# EAGLE design esp8266player3 (EAGLE 6.4)
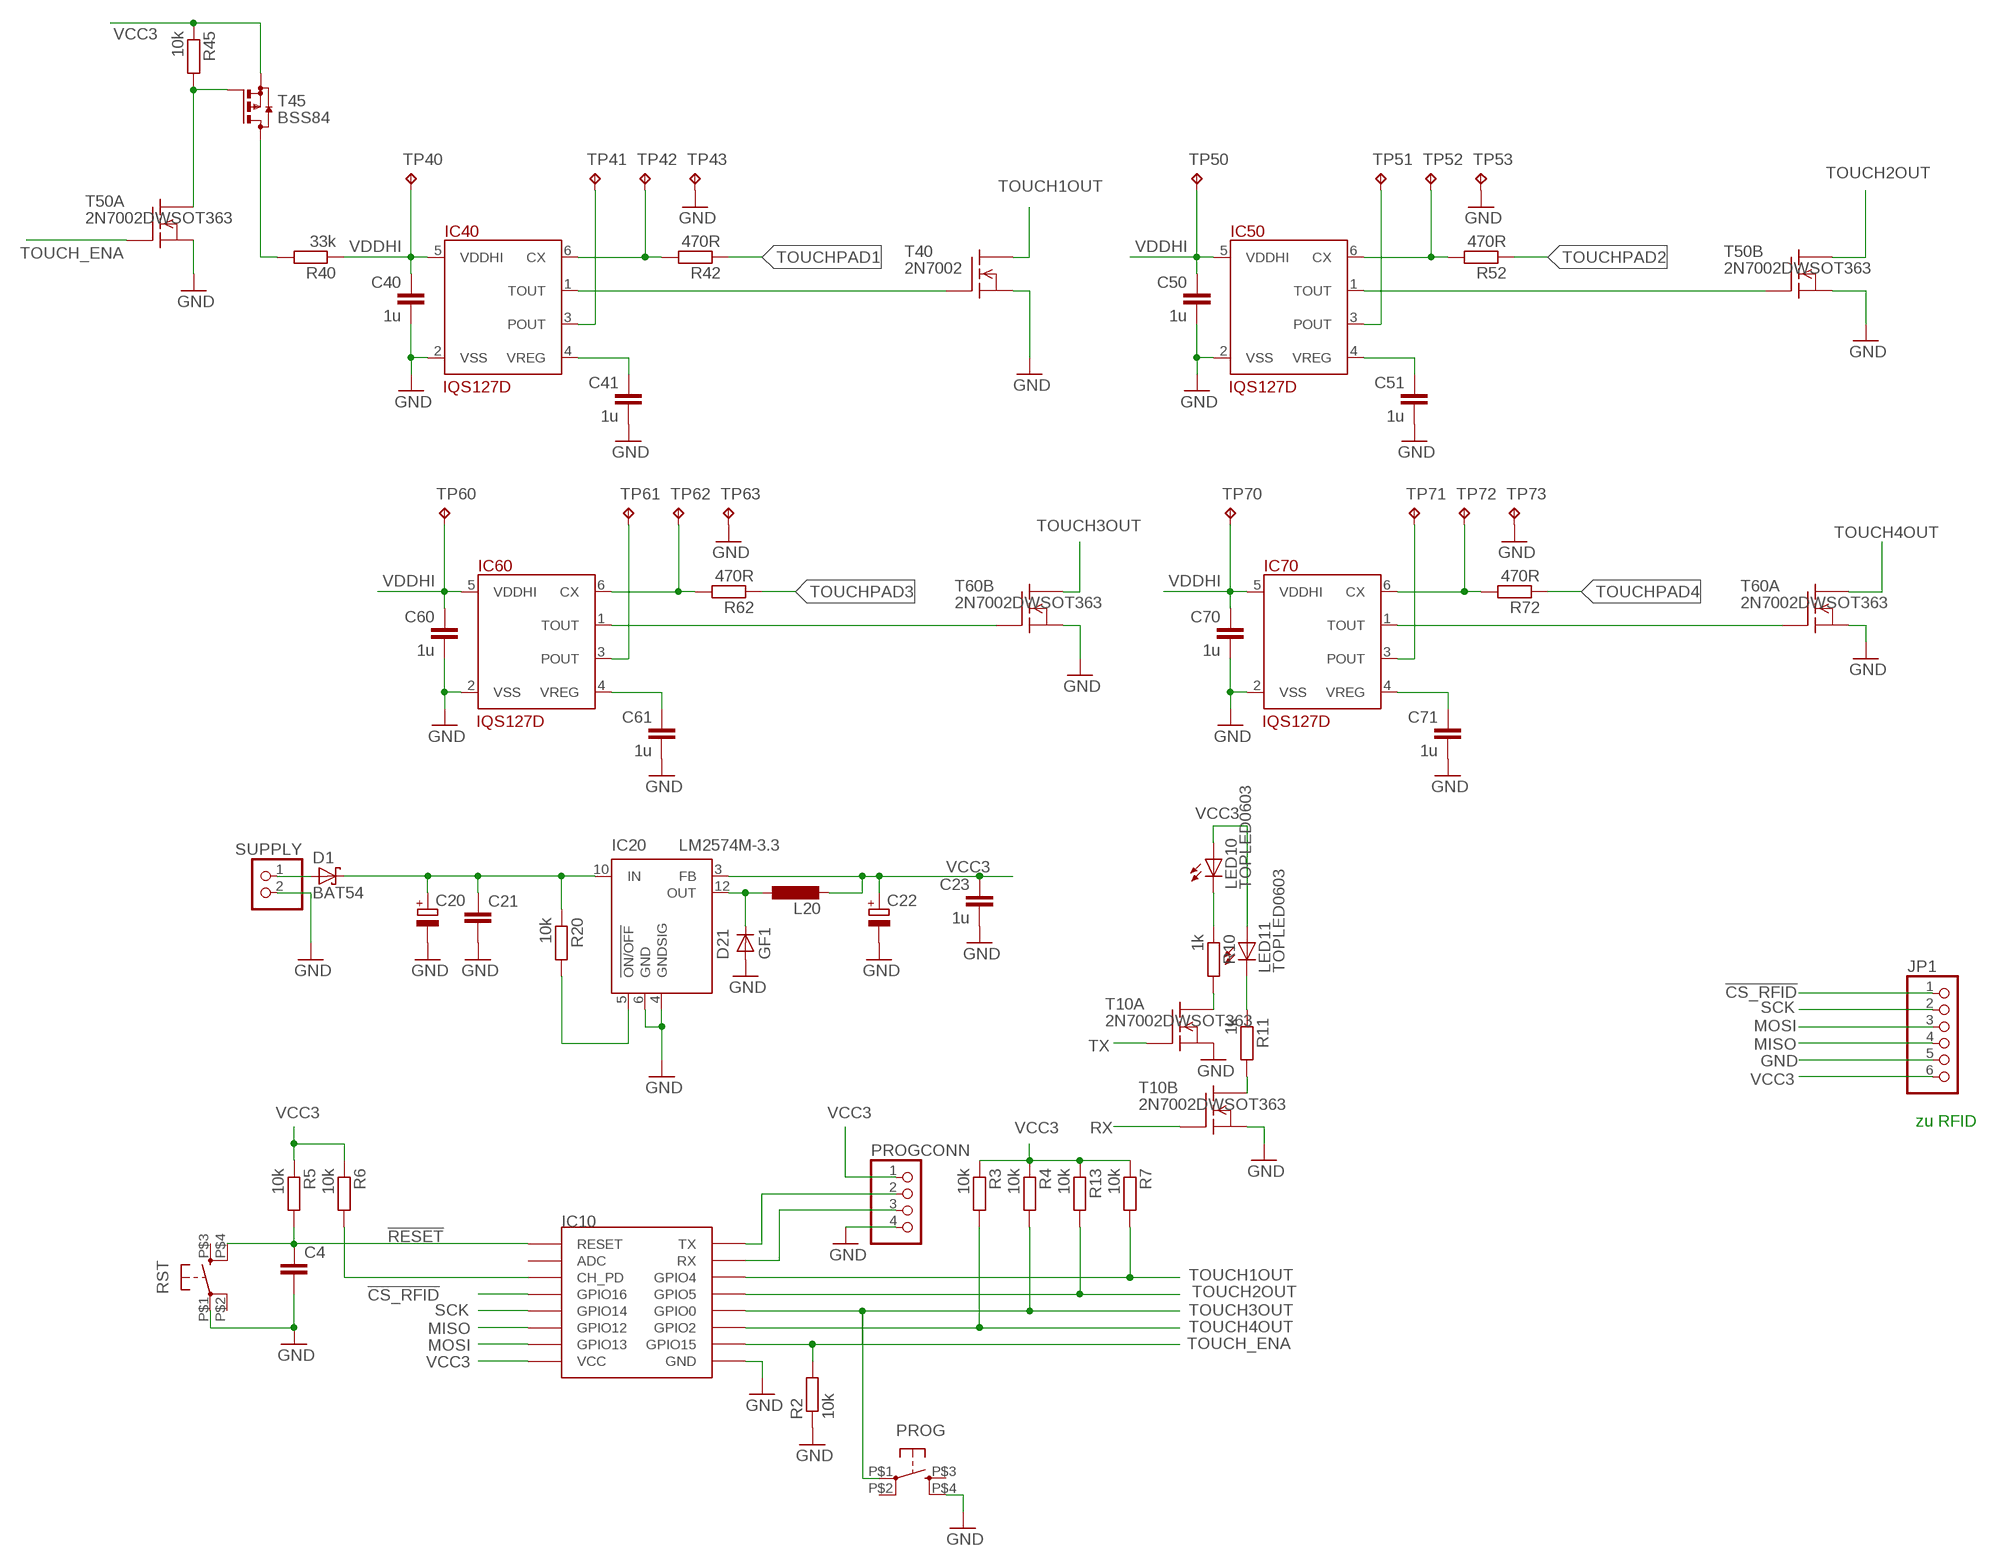
[diagram p0: schematic, sheet 1]

## Parts
C4  C-EUC0603  [C0603]
C20  CPOL-EUC  [PANASONIC_C]
C21  C-EUC1206  [C1206]
C22  CPOL-EUF  [PANASONIC_F]
C23  1u  C-EUC0603  [C0603]
C40  1u  C-EUC0603  [C0603]
C41  1u  C-EUC0603  [C0603]
C50  1u  C-EUC0603  [C0603]
C51  1u  C-EUC0603  [C0603]
C60  1u  C-EUC0603  [C0603]
C61  1u  C-EUC0603  [C0603]
C70  1u  C-EUC0603  [C0603]
C71  1u  C-EUC0603  [C0603]
D1  BAT54  [SOT23]
D21  GF1  [SMA-DO214AC]
IC10  ESP12SMD  [ESP12-SMD]
IC20  LM2574M-3.3  [SO14W]
IC40  IQS127D  [SOT23-6]
IC50  IQS127D  [SOT23-6]
IC60  IQS127D  [SOT23-6]
IC70  IQS127D  [SOT23-6]
JP1  PINHD-1X6  [1X06]
L20  L-EUSRR0603  [SRR6603-BOURNS]
LED10  TOPLED0603  [LED-0603-OSRAM]
LED11  TOPLED0603  [LED-0603-OSRAM]
PROG  10-XXTL3305  [TL3305]
PROGCONN  PINHD-1X4  [1X04]
R2  10k  R-EU_R0603  [R0603@1]
R3  10k  R-EU_R0603  [R0603@1]
R4  10k  R-EU_R0603  [R0603@1]
R5  10k  R-EU_R0603  [R0603@1]
R6  10k  R-EU_R0603  [R0603@1]
R7  10k  R-EU_R0603  [R0603@1]
R10  1k  R-EU_R0603  [R0603@1]
R11  1k  R-EU_R0603  [R0603@1]
R13  10k  R-EU_R0603  [R0603@1]
R20  10k  R-EU_R0603  [R0603@1]
R40  33k  R-EU_R0603  [R0603@1]
R42  470R  R-EU_R0603  [R0603@1]
R45  10k  R-EU_R0603  [R0603@1]
R52  470R  R-EU_R0603  [R0603@1]
R62  470R  R-EU_R0603  [R0603@1]
R72  470R  R-EU_R0603  [R0603@1]
RST  10-XXTL3305  [TL3305]
SUPPLY  PINHD-1X2  [1X02]
T10  2N7002DWSOT363  [SOT363]
T40  2N7002  [SOT23]
T45  BSS84  [SOT23]
T50  2N7002DWSOT363  [SOT363]
T60  2N7002DWSOT363  [SOT363]
TP40  TPB1,27  [B1,27]
TP41  TPB1,27  [B1,27]
TP42  TPB1,27  [B1,27]
TP43  TPB1,27  [B1,27]
TP50  TPB1,27  [B1,27]
TP51  TPB1,27  [B1,27]
TP52  TPB1,27  [B1,27]
TP53  TPB1,27  [B1,27]
TP60  TPB1,27  [B1,27]
TP61  TPB1,27  [B1,27]
TP62  TPB1,27  [B1,27]
TP63  TPB1,27  [B1,27]
TP70  TPB1,27  [B1,27]
TP71  TPB1,27  [B1,27]
TP72  TPB1,27  [B1,27]
TP73  TPB1,27  [B1,27]

## Nets
!CS_RFID: IC10.GPIO16 JP1.1
!RESET: C4.1 IC10.RESET R5.2 RST.P$4(S1)
GND: C4.2 C20.- C21.2 C22.- C23.2 C40.2 C41.2 C50.2 C51.2 C60.2 C61.2 C70.2 C71.2 D21.A IC10.GND IC20.4(GNDSIG) IC20.6(GND) IC40.2(VSS) IC50.2(VSS) IC60.2(VSS) IC70.2(VSS) JP1.5 PROG.P$4(S1) PROGCONN.4 R2.1 RST.P$1(P) SUPPLY.2 T10.1(B:S) T10.4(A:S) T40.2(S) T50.1(B:S) T50.4(A:S) T60.1(B:S) T60.4(A:S) TP43.TP TP53.TP TP63.TP TP73.TP
MISO: IC10.GPIO12 JP1.4
MOSI: IC10.GPIO13 JP1.3
N$1: IC20.5(!ON/OFF) R20.2
N$2: D1.1(A) SUPPLY.1
N$3: R11.2 T10.6(B:D)
N$4: LED11.K@1(C) R11.1
N$5: D21.K(C) IC20.12(OUT) L20.1
N$6: LED10.K@1(C) R10.1
N$7: R10.2 T10.3(A:D)
N$9: IC10.CH_PD R6.2
POUT_PROT1: IC60.3(POUT) TP61.TP
POUT_PROT2: IC40.3(POUT) TP41.TP
POUT_PROT3: IC70.3(POUT) TP71.TP
POUT_PROT4: IC50.3(POUT) TP51.TP
RX: IC10.RXD0(RX) PROGCONN.3 T10.2(B:G)
SCK: IC10.GPIO14 JP1.2
TOUCH1: IC40.1(TOUT) T40.1(G)
TOUCH1OUT: IC10.GPIO4 R7.2 T40.3(D)
TOUCH2: IC50.1(TOUT) T50.2(B:G)
TOUCH2OUT: IC10.GPIO5 R13.2 T50.6(B:D)
TOUCH3: IC60.1(TOUT) T60.2(B:G)
TOUCH3OUT: IC10.GPIO0 PROG.P$1(P) R4.2 T60.6(B:D)
TOUCH4: IC70.1(TOUT) T60.5(A:G)
TOUCH4OUT: IC10.GPIO2 R3.2 T60.3(A:D)
TOUCH_ENA: IC10.GPIO15 R2.2 T50.5(A:G)
TOUCH_ENA2: R45.2 T45.1(G) T50.3(A:D)
TOUCHPAD1: R42.1
TOUCHPAD2: R52.1
TOUCHPAD3: R62.1
TOUCHPAD4: R72.1
TT: IC60.6(CX) R62.2 TP62.TP
TT1: IC40.6(CX) R42.2 TP42.TP
TT2: IC70.6(CX) R72.2 TP72.TP
TT3: IC50.6(CX) R52.2 TP52.TP
TX: IC10.TXD0(TX) PROGCONN.2 T10.5(A:G)
VCC3: C22.+ C23.1 IC10.VCC IC20.3(FB) JP1.6 L20.2 LED10.A@1(A) LED11.A@1(A) PROGCONN.1 R3.1 R4.1 R5.1 R6.1 R7.1 R13.1 R45.1 T45.2(S)
VCC3_TOUCH: R40.2 T45.3(D)
VDDHI [supply]: C40.1 C50.1 C60.1 C70.1 IC40.5(VDDHI) IC50.5(VDDHI) IC60.5(VDDHI) IC70.5(VDDHI) R40.1 TP40.TP TP50.TP TP60.TP TP70.TP
VIN: C20.+ C21.1 D1.3(C) IC20.10(IN) R20.1
VREG1: C61.1 IC60.4(VREG)
VREG2: C41.1 IC40.4(VREG)
VREG3: C71.1 IC70.4(VREG)
VREG4: C51.1 IC50.4(VREG)
Unconnected: IC10.ADC PROG.P$2(P1) PROG.P$3(S) RST.P$2(P1) RST.P$3(S)

## Notes on the sheet
- zu RFID

## Library data of the parts
C4 C21 C23 C40 C41 C50 C51 C60 C61 C70 C71 = myKNX:C-EU: CAPACITOR, European symbol
C20 C22 = resistor:CPOL-EU: POLARIZED CAPACITOR, European symbol
D1 = diode:BAT54: Schottky Diodes Source: Fairchild .. BAT54.pdf
D21 = diode:GF1: DIODE
IC10 = esp8266:ESP12: ESP8266 Wifi module 12
IC20 = linear:LM2574?-*: SIMPLE SWITCHER 0.5A Step-Down Voltage Regulator Source: http://cache.national.com/ds/LM/LM2574.pdf
IC40 IC50 IC60 IC70 = myKNX:IQS127D
JP1 = pinhead:PINHD-1X6: PIN HEADER
L20 = myKNX:L-EU: INDUCTOR, European symbol
LED10 LED11 = myKNX:TOPLED
PROG RST = myKNX:10-XX: OMRON SWITCH
PROGCONN = pinhead:PINHD-1X4: PIN HEADER
R2-R7 R10 R11 R13 R20 R40 R42 R45 R52 R62 R72 = myKNX:R-EU_: RESISTOR, European symbol
SUPPLY = myKNX:PINHD-1X2: PIN HEADER
T10 T50 T60 = myKNX:2N7002DW
T40 = myKNX:2N7002
T45 = transistor-small-signal:BSS84: P-CHANNEL MOS FET
TP40-TP43 TP50-TP53 TP60-TP63 TP70-TP73 = testpad:TP: Test pad

## Net classes
1 supply: width 0.15 mm

## Board
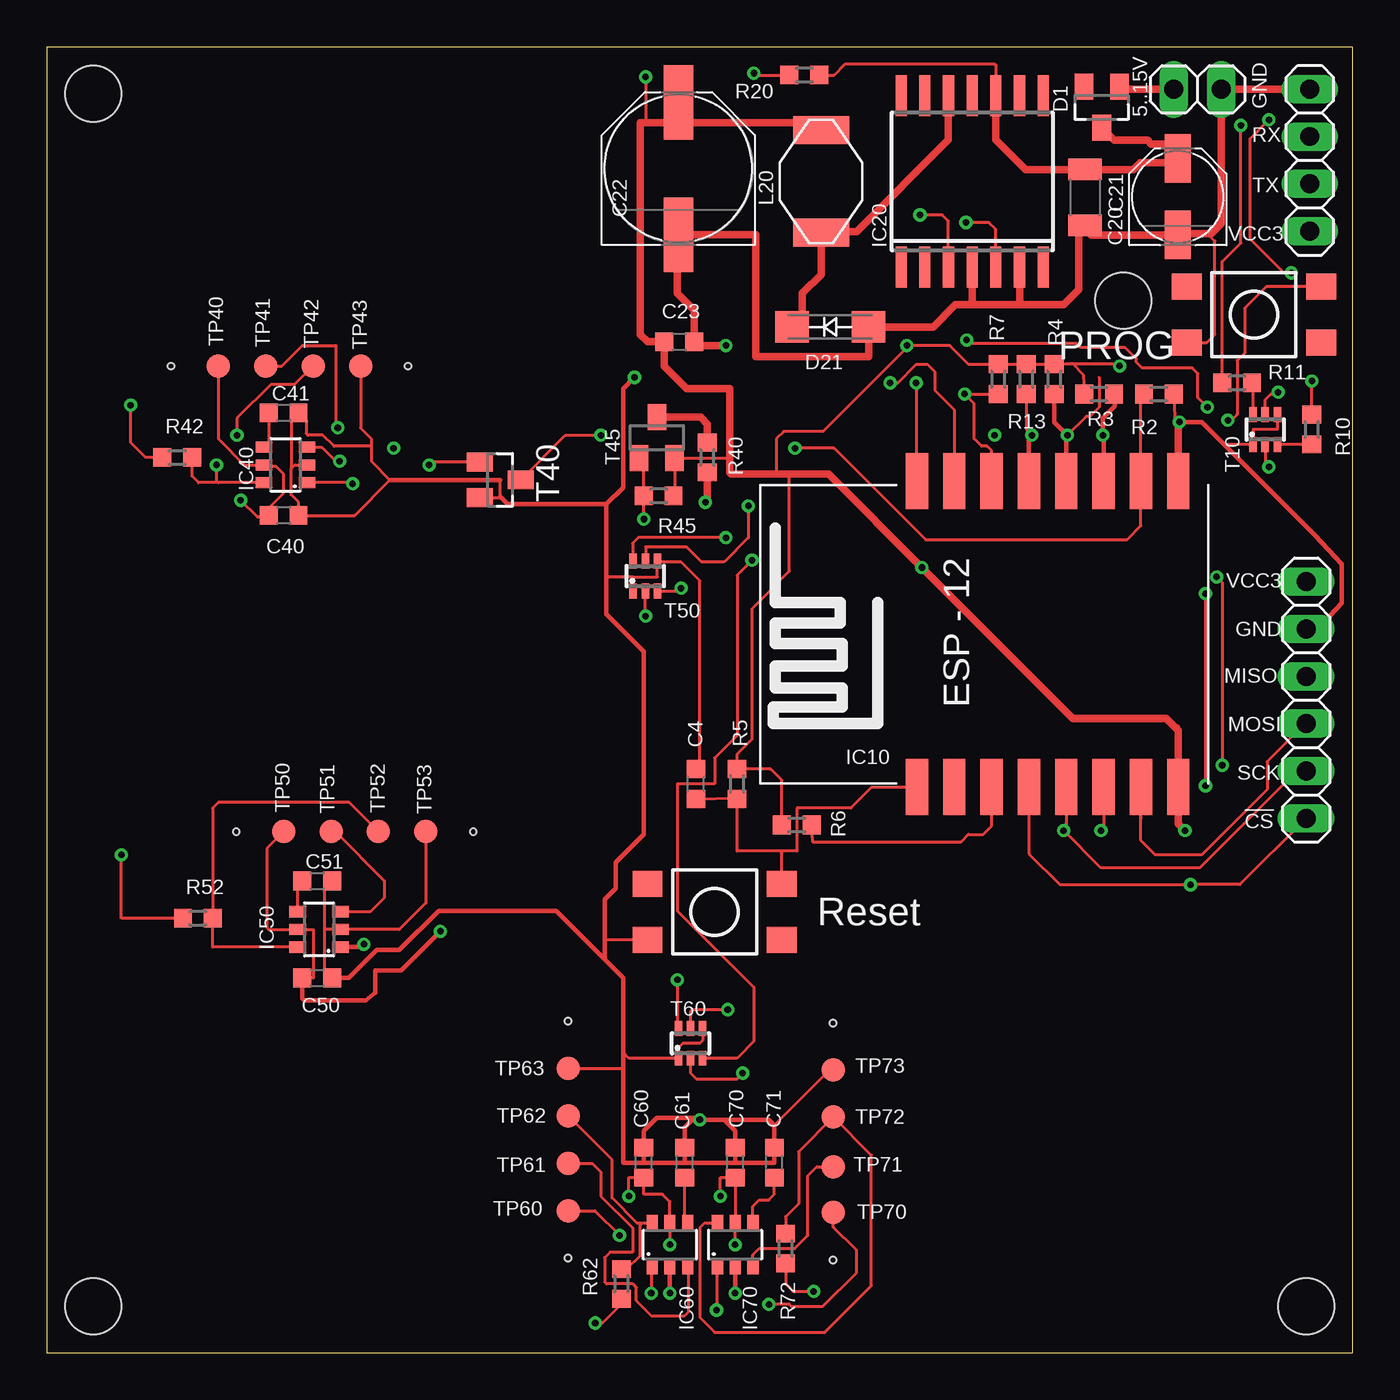
[diagram p1: board, top side]
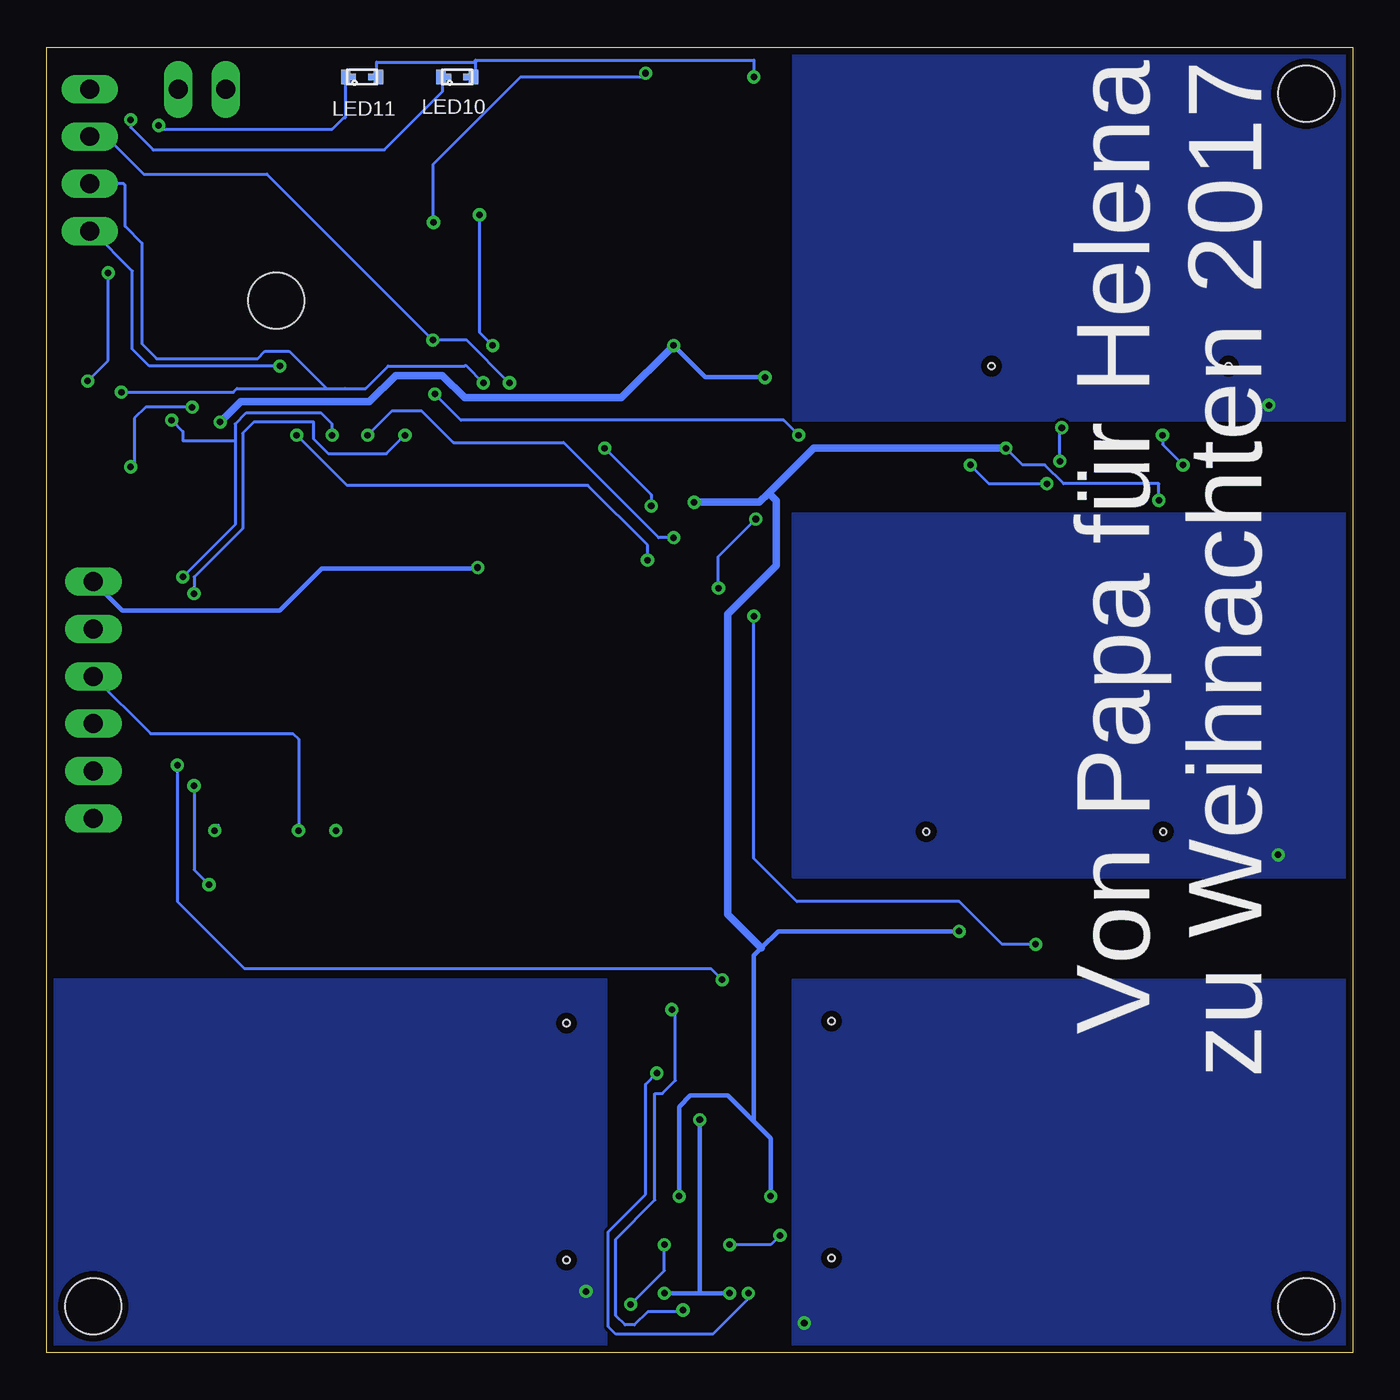
[diagram p2: board, bottom side, seen from below]

Size 70 x 70 mm. Coordinates in mm from the lower left corner, seen from the top.
Outline: 0,0 70,0 70,70 0,70 0,0
Copper layers (1*16): Top 0.0356mm / dielectric 1.5011mm / Bottom 0.0356mm
Design rules "OSHPark": minimum track width 6mil, minimum drill 13mil, track to track 6mil, track to pad 6mil, pad to pad 6mil, via to via 6mil, smd to smd 6mil, copper to edge 15mil, drill to drill 6mil, minimum pad ring 7mil, minimum via ring 7mil, stop-mask expansion 4mil, vias tented up to drill 0mil, thermal gap 10mil
Holes 0.35 mm at 42.14,17.68 42.14,4.98 27.94,17.78 27.94,5.08 10.16,27.94 22.86,27.94 6.66,52.9 19.36,52.9
Holes 3 mm at 2.5,2.5 67.5,2.5 57.7,56.4 2.5,67.5

### Footprints (pad centres in the part's own frame; a part is rotated, then mirrored left to right if it is on the bottom)
C0603 = smd 0.95 x 1: 1 -0.8,0; 2 0.8,0
PANASONIC_C = smd 2.6 x 1.4: + 2.05,0; - -2.05,0
C1206 = smd 1.15 x 1.8: 1 -1.5,0; 2 1.5,0
PANASONIC_F = smd 4 x 1.6: + 3.55,0; - -3.55,0
SOT23 = smd 1 x 1.4: 1 -0.95,-1.1; 2 0.95,-1.1; 3 0,1.1
SMA-DO214AC = smd 1.8 x 1.7: A -2.05,0; K 2.05,0
ESP12-SMD = smd 3 x 1.2: ADC -8.3,3.8; CH_PD -8.3,1.8; GND 8.1,-8.2; GPIO0 8.1,-2.2; GPIO2 8.1,-4.2; GPIO4 8.1,1.8; GPIO5 8.1,-0.2; GPIO12 -8.3,-4.2; GPIO13 -8.3,-6.2; GPIO14 -8.3,-2.2; GPIO15 8.1,-6.2; GPIO16 -8.3,-0.2; RESET -8.3,5.8; RXD0 8.1,3.8; TXD0 8.1,5.8; VCC -8.3,-8.2
SO14W = smd 0.6 x 2.2: 1 -3.81,-4.6; 2 -2.54,-4.6; 3 -1.27,-4.6; 4 0,-4.6; 5 1.27,-4.6; 6 2.54,-4.6; 7 3.81,-4.6; 8 3.81,4.6; 9 2.54,4.6; 10 1.27,4.6; 11 0,4.6; 12 -1.27,4.6; 13 -2.54,4.6; 14 -3.81,4.6
SOT23-6 = smd 0.6 x 0.9: 1 -0.95,-1.15; 2 0,-1.15; 3 0.95,-1.15; 4 0.95,1.15; 5 0,1.15; 6 -0.95,1.15
1X06 = drill 1.016 long: 1 -6.35,0; 2 -3.81,0; 3 -1.27,0; 4 1.27,0; 5 3.81,0; 6 6.35,0
SRR6603-BOURNS = smd 1.5 x 3: 1 -2.75,0; 2 2.75,0
LED-0603-OSRAM = smd 0.5 x 0.8: A@1 0.875,0; K@1 -0.875,0 | smd 0.8 x 0.35: A@2 0.725,0; K@2 -0.725,0
TL3305 = smd 1.6 x 1.4: P$1 -3.6,-1.5; P$2 3.6,-1.5; P$3 -3.6,1.5; P$4 3.6,1.5
1X04 = drill 1.016 long: 1 -3.81,0; 2 -1.27,0; 3 1.27,0; 4 3.81,0
R0603@1 = smd 0.95 x 1: 1 -0.8,0; 2 0.8,0
1X02 = drill 1.016 long: 1 -1.27,0; 2 1.27,0
SOT363 = smd 0.4 x 0.8: 1 -0.65,-0.8; 2 0,-0.8; 3 0.65,-0.8; 4 0.65,0.8; 5 0,0.8; 6 -0.65,0.8
B1,27 = smd 1.27 x 1.27: TP 0,0

### Placement (x,y rotation side)
C4  34.8,30.5 90 top
C20  60.62,61.97 90 top
C21  55.64,61.94 270 top
C22  33.86,63.49 90 top
C23  33.9,54.2 0 top
C40  12.7,44.9 0 top
C41  12.7,50.4 0 top
C50  14.5,20.1 0 top
C51  14.5,25.3 0 top
C60  32,10.2 90 top
C61  34.2,10.2 90 top
C70  36.9,10.2 90 top
C71  39,10.2 90 top
D1  56.54,66.77 180 top
D21  42,55 180 top
IC10  52.44,38.63 90 top
IC20  49.6,62.8 0 top
IC40  12.8,47.6 90 top
IC50  14.6,22.7 90 top
IC60  33.4,5.8 0 top
IC70  36.9,5.8 0 top
JP1  67.5,35 90 top
L20  41.5,62.8 90 top
LED10  48,68.4 0 bottom
LED11  53.1,68.4 0 bottom
PROG  64.7,55.66 180 top
PROGCONN  67.69,63.94 90 top
R2  59.6,51.4 180 top
R3  56.4,51.4 0 top
R4  54,52.2 270 top
R5  37,30.5 270 top
R6  40.2,28.3 0 top
R7  51,52.2 270 top
R10  67.8,49.5 270 top
R11  63.8,52 0 top
R13  52.5,52.2 270 top
R20  40.6,68.5 180 top
R40  35.4,48 90 top
R42  7,48 0 top
R45  32.8,45.94 180 top
R52  8.1,23.3 0 top
R62  30.8,3.7 90 top
R72  39.6,5.6 90 top
RST  35.8,23.64 0 top
SUPPLY  61.67,67.74 0 top
T10  65.3,49.5 0 top
T40  24.3,46.8 270 top
T45  32.7,49.06 0 top
T50  32.08,41.64 0 top
T60  34.5,16.6 0 top
TP40  9.2,52.9 0 top
TP41  11.74,52.9 0 top
TP42  14.28,52.9 0 top
TP43  16.82,52.9 0 top
TP50  12.7,27.94 0 top
TP51  15.24,27.94 0 top
TP52  17.78,27.94 0 top
TP53  20.32,27.94 0 top
TP60  27.94,7.62 0 top
TP61  27.94,10.16 0 top
TP62  27.94,12.7 0 top
TP63  27.94,15.24 0 top
TP70  42.16,7.54 0 top
TP71  42.16,9.98 0 top
TP72  42.16,12.64 0 top
TP73  42.16,15.17 0 top

### Tracks (layer width: path | path; a pad name or v marks a point on that pad's centre or on a via)
!CS_RFID  (via drill 0.35)
  Top 0.152: 51,49.4 v50.8,49.2 | v62.1,40.7 v62.1,30.4 | JP1.1 63.95,25.1 v61.3,25.1 54.3,25.1 52.64,26.76 IC10.GPIO16
  Top 0.254: 50.64,49.04 v50.8,49.2
  Bottom 0.152: v50.8,49.2 51.8,48.2 54.9,48.2 55.7,49 55.7,49.9 58.9,49.9 59.5,49.3 59.5,44.2 62.1,41.6 v62.1,40.7 | v62.1,30.4 62.1,25.9 v61.3,25.1
!RESET
  Top 0.152: IC10.RESET 44.23,30.33 43.1,29.2 40.2,29.2 40.2,26.9 39.3,26.9 | C4.1 36.9,29.75 R5.2 37,26.9 39.3,26.9 | RST.P$4 39.4,26.8 39.3,26.9
GND  (via drill 0.35)
  Top 0.152: R2.1 60.45,50.15 v60.7,49.9 | T60.4 35.15,16.75 35,16.6 34.1,16.6 33.85,16.35 T60.1 31.2,15.8 30.9,16.1 | TP63.TP 30.86,15.24 | 30.86,15.24 30.9,15.2 | 30.86,15.24 30.86,16.26 30.9,16.3 | TP73.TP 41.97,15.17 39,12.2 | 14.9,22.7 IC50.2 18.9,22.7 20.32,24.12 TP53.TP | 14.9,20 14.9,20.1 | 14.9,20.1 14.9,22.7 | 14.9,22.7 14.9,25.3 C51.2 | T50.1 31.43,41.6 | 31.43,41.6 32.73,41.6 T50.4 32.77,42.4 34,42.4 35,41.4 35,31.5 C4.2 | 31.43,41.6 30.1,41.6 30,41.5 | 13.1,47.4 13.1,46 13.5,45.6 C40.2 16.5,44.9 18.4,46.8 17.4,47.8 17.4,48.6 | 13.1,47.4 13.3,47.6 IC40.2 | 13.1,47.4 13.1,50 C41.2 13.9,50 13.9,49.3 14,49.2 14.8,49.2 15.4,48.6 17.4,48.6 | 17.4,48.6 17.4,49 16.82,49.58 TP43.TP | C50.2 14.9,20.1 | RST.P$1 29.96,22.14 29.9,22.2 | T40.2 24.25,45.85 24.3,45.9 24.3,46.8 | T10.4 65.95,49.5 64.65,49.5 T10.1 63.1,48.7 62.6,49.2 | PROG.P$4 62.16,54.16 62.6,54.6 62.6,59.6 62.2,60
  Top 0.254: 60.64,49.84 v60.7,49.9 61.9,49.9 62.6,49.2 67.96,43.84 69.4,42.3 69.4,40.2 68.11,38.81 JP1.5 | IC70.2 v36.9,3.2 | IC60.2 v33.4,3.2 | C71.2 39,12.2 38.7,12.5 36.3,12.5 | 36.3,12.5 v35,12.5 | C70.2 36.9,11.9 36.3,12.5 | v35,12.5 34.6,12.5 34.2,12.1 C61.2 34.2,10.2 | v35,12.5 34.9,12.6 32.7,12.6 32,11.9 C60.2 32,10.2 | 34.2,10.2 32,10.2 | 32,10.2 30.9,10.2 30.9,16.1 30.9,16.3 30.9,20.1 29.9,21.1 | 34.2,10.2 36.9,10.2 | 36.9,10.2 39,10.2 39,10.9 | 36.9,10.2 36.9,10.9 | 29.9,21.1 27.3,23.7 21,23.7 18.9,21.6 17.7,21.6 16.2,20.1 C50.2 | 30,45.5 30,41.5 30,39.6 32,37.6 32,27.8 30.5,26.3 30.5,24.9 29.9,24.3 29.9,22.2 29.9,21.1 | 18.4,46.8 24.3,46.8 | 30,45.5 30.9,46.4 30.9,51.7 v31.5,52.3 | 24.3,45.9 24.7,45.5 30,45.5
  Top 0.4: IC10.GND 60.64,49.84
  Top 0.406: PROGCONN.4 SUPPLY.2 62.94,60.54 62.4,60 62.2,60 60.7,60 C20.- 55.98,59.92 55.46,60.44 C21.2 55.3,60.1 55.3,57 54.5,56.2 52.1,56.2 | v36.4,54 34.9,54 C23.2 34.7,55.9 33.8,56.8 33.8,60.2 34,60.4 34,60.08 C22.- 38,59.94 38,53.4 44.05,53.4 D21.A 47.5,55 48.7,56.2 49.7,56.2 | 52.1,56.2 49.7,56.2 | IC20.4 49.6,56.3 49.7,56.2 | IC20.6 52.14,56.24 52.1,56.2
  Bottom 0.254: v33.4,3.2 35,3.2 | 35,3.2 v36.9,3.2 | 35,3.2 v35,12.5 | v31.5,52.3 34.7,52.3 v36.4,54
  Bottom 0.406: v36.4,54 39.2,51.2 47.6,51.2 48.8,52.4 51.3,52.4 52.7,51 59.6,51 v60.7,49.9
MISO  (via drill 0.35)
  Top 0.152: IC10.GPIO12 56.64,28.14 v56.5,28
  Bottom 0.152: JP1.4 64.43,33.2 56.8,33.2 56.5,32.9 v56.5,28
MOSI
  Top 0.152: 58.64,28.64 IC10.GPIO13 58.64,27.46 59.4,26.7 61.9,26.7 65.4,30.2 65.4,31.7 67.43,33.73 JP1.3
N$1  (via drill 0.35)
  Top 0.152: v37.9,68.6 38,68.5 R20.2 | IC20.5 50.87,60.23 50.5,60.6 v49.27,60.6
  Bottom 0.152: v49.27,60.6 49.27,63.73 44.6,68.4 38.1,68.4 v37.9,68.6
N$2
  Top 0.406: D1.1 57.62,67.74 SUPPLY.1
N$3
  Top 0.152: T10.6 64.65,52 R11.2
N$4  (via drill 0.35)
  Top 0.152: R11.1 63,58.5 64,59.5 v64,65.8
  Bottom 0.152: v64,65.8 63.8,65.6 54.7,65.6 54.08,66.22 53.98,66.22 LED11.K@1
N$5
  Top 0.406: D21.K 40.5,55.55 40.5,56.8 41.5,57.8 L20.1 41.55,60.1 43.4,60.1 48.33,65.03 IC20.12
N$6  (via drill 0.35)
  Top 0.152: R10.1 v67.8,52.1 | v66.7,57.9 66.3,57.9 64.5,59.7 64.5,65.1 v65.5,66.1
  Bottom 0.152: v67.8,52.1 66.7,53.2 v66.7,57.9 | v65.5,66.1 65.5,65.7 64.3,64.5 51.9,64.5 48.77,67.62 48.77,68.4 LED10.K@1
N$7
  Top 0.152: R10.2 T10.3
N$9
  Top 0.152: IC10.CH_PD 50.64,28.24 50.2,27.8 49.4,27.8 49,27.4 41.05,27.4 R6.2
POUT_PROT1
  Top 0.152: TP61.TP 29.24,10.16 29.7,9.7 29.7,8.4 31.4,6.7 31.4,5.4 30.2,5.4 29.9,5.1 29.9,3.8 30,3.7 31.4,3.7 31.6,3.5 31.6,2.8 32.4,2 34.2,2 34.4,2.2 34.4,4.6 IC60.3
POUT_PROT2  (via drill 0.35)
  Top 0.152: TP41.TP 12.6,52.9 13.7,54 15.5,54 15.5,49.7 v15.6,49.6 | IC40.3 14.75,48.55 15.5,47.8 v15.7,47.8
  Bottom 0.152: v15.7,47.8 15.7,49.5 v15.6,49.6
POUT_PROT3
  Top 0.152: IC70.3 37.85,5.25 38.2,5.6 40.1,5.6 40.8,6.3 40.8,9.5 41.28,9.98 TP71.TP
POUT_PROT4
  Top 0.152: TP51.TP 15.46,27.94 18.1,25.3 18.1,24.4 17.35,23.65 IC50.3
RX  (via drill 0.35)
  Top 0.152: v45.2,52 45.6,52 46.6,53 47.2,53 47.6,52.6 47.6,51.6 48.64,50.56 IC10.RXD0 | T10.2 65.3,47.7 v65.5,47.5 | v62.2,50.7 61.7,51.2 61.7,52.5 61.4,52.8 58.7,52.8 58.4,53.1 58.4,53.3 57.8,53.9 55.4,53.9 55.2,54.1 49.5,54.1 v49.3,54.3
  Bottom 0.152: PROGCONN.3 66.81,65.21 64.8,63.2 58.2,63.2 v49.3,54.3 47.5,54.3 v45.2,52 | 65.4,47.5 v65.5,47.5 65.3,47.7 65.3,50.1 64.7,50.7 v62.2,50.7
SCK  (via drill 0.35)
  Top 0.152: IC10.GPIO14 54.64,28.14 v54.5,28 56.5,26 61.8,26 66.99,31.19 JP1.2
TOUCH1  (via drill 0.35)
  Top 0.152: v16.4,46.6 16.35,46.65 IC40.1 | T40.1 20.65,47.75 v20.5,47.6
  Bottom 0.152: v20.5,47.6 19.5,46.6 v16.4,46.6
TOUCH1OUT  (via drill 0.35)
  Top 0.152: T40.3 27.8,49.2 v29.7,49.2 | R7.2 v49.2,51.4 49.7,50.9 49.7,49 50.1,48.6 50.4,48.6 50.64,48.36 IC10.GPIO4
  Bottom 0.152: v29.7,49.2 30.5,50 47.8,50 v49.2,51.4
TOUCH2  (via drill 0.35)
  Top 0.152: v32.1,39.5 32.08,39.52 T50.2
  Top 0.254: IC50.1 16.85,21.75 v17,21.9
  Bottom 0.152: v17,21.9 18.8,21.9 21.1,24.2 29.8,24.2 32.1,26.5 v32.1,39.5
TOUCH2OUT  (via drill 0.35)
  Top 0.152: R13.2 52.5,49.5 v52.8,49.2 | v36.4,43.7 31.7,43.7 31.4,43.4 31.4,42.47 T50.6
  Top 0.254: IC10.GPIO5 52.64,49.04 v52.8,49.2
  Bottom 0.152: v52.8,49.2 51.5,50.5 49.9,50.5 48.2,48.8 42.3,48.8 37.2,43.7 v36.4,43.7
TOUCH3  (via drill 0.35)
  Top 0.152: IC60.1 32.4,4.6 v32.4,3.2 | T60.2 34.5,15 34.8,14.7 37,14.7 v37.3,15
  Bottom 0.152: v32.4,3.2 32.4,2.9 34.3,1 39.5,1 39.9,1.4 39.9,6.5 37.9,8.5 37.9,14.4 v37.3,15
TOUCH3OUT  (via drill 0.35)
  Top 0.152: 56.4,52.3 56.4,50.7 55.9,50.2 55.7,50.2 v54.7,49.2 | v62.7,41.6 63,41.3 v63,31.5 | PROG.P$1 65.36,57.16 64.2,56 64.2,53.6 63.8,53.2 63.8,50.3 63.5,50 v63.3,50 | v33.8,20 33.8,17.45 T60.6
  Top 0.254: IC10.GPIO0 54.64,49.14 v54.7,49.2 54,49.9 R4.2
  Bottom 0.152: v54.7,49.2 54.7,49.8 55.3,50.4 59.3,50.4 59.9,49.8 59.9,48.9 | 59.9,48.9 59.9,44.4 v62.7,41.6 | v63,31.5 63,24.2 59.4,20.6 34.4,20.6 v33.8,20 | v63.3,50 62.7,49.4 62.7,48.9 59.9,48.9
TOUCH4  (via drill 0.35)
  Top 0.152: IC70.1 35.9,4.6 v35.9,2.3 | v36.5,18.4 34.6,18.4 34.5,18.3 T60.5
  Bottom 0.152: v35.9,2.3 36,2.2 37.8,2.2 38.5,1.5 39,1.5 39.5,2 39.5,6.1 37.4,8.2 37.4,13.9 37,13.9 36.3,14.6 36.3,18.2 v36.5,18.4
TOUCH4OUT  (via drill 0.35)
  Top 0.152: v37.8,42.5 37.01,41.7 37.01,33.1 35.8,31.9 35.8,30.5 33.8,30.5 33.8,23.7 37.9,19.6 37.9,16.7 37,15.8 T60.3
  Top 0.254: IC10.GPIO2 56.64,49.16 v56.6,49.2 56.6,50.1 57.25,50.75 R3.2
  Bottom 0.152: v56.6,49.2 53.9,46.5 41,46.5 37.8,43.3 v37.8,42.5
TOUCH_ENA  (via drill 0.35)
  Top 0.152: 58.7,51.4 R2.2 58.64,51.29 IC10.GPIO15 58.64,44.34 57.9,43.6 47.1,43.6 42.2,48.5 v40.1,48.5 | v37.6,45.4 37.6,43.7 36.3,42.4 35.1,42.4 34.3,43.2 32.1,43.2 32.1,42.46 T50.5
  Bottom 0.152: v40.1,48.5 37.6,46 v37.6,45.4
TOUCH_ENA2  (via drill 0.35)
  Top 0.152: T50.3 33.84,40.84 v34,41 | v32,44.7 R45.2 32,47.71 T45.1
  Bottom 0.152: v34,41 34,42.7 v32,44.7
TOUCHPAD1  (via drill 0.35)
  Top 0.152: R42.1 5.3,48 4.5,48.8 v4.5,50.8
  pour Bottom: 0,70 30,70 30,50 0,50
TOUCHPAD2  (via drill 0.35)
  Top 0.152: R52.1 4,23.3 v4,26.7
  pour Bottom: 0,25.5 30,25.5 30,45 0,45
TOUCHPAD3  (via drill 0.35)
  Top 0.152: R62.1 30.8,2.6 29.8,1.6 v29.4,1.6
  pour Bottom: 0,0 30,0 30,20 0,20
TOUCHPAD4  (via drill 0.35)
  Top 0.152: R72.1 39.6,3.7 40,3.3 v41.1,3.3
  pour Bottom: 70,0 40,0 40,20 70,20
TT
  Top 0.152: IC60.6 31.9,6.95 | 31.9,6.95 31.65,6.95 30.3,8.3 30.3,10.34 TP62.TP | R62.2 31.1,4.5 31.8,5.2 31.8,6.85 31.9,6.95
TT1  (via drill 0.35)
  Top 0.152: IC40.6 9.2,46.65 | 9.2,46.65 8.15,46.65 7.8,47 R42.2 | TP42.TP 13.28,51.9 12,51.9 10.2,50.1 v10.2,49.2 | v9.1,47.6 9.1,46.75 9.2,46.65
  Bottom 0.152: v10.2,49.2 10.2,48.7 v9.1,47.6
TT2
  Top 0.152: R72.2 39.6,7.3 40.3,8 40.3,10.78 TP72.TP 44.2,10.6 44.2,3.6 41.7,1.1 35.8,1.1 35,1.9 35,6.7 35.25,6.95 IC70.6
TT3
  Top 0.152: IC50.6 8.9,21.75 R52.2 8.9,29.2 9.2,29.5 16.22,29.5 TP52.TP
TX  (via drill 0.35)
  Top 0.152: v46.6,52 46.6,46.77 IC10.TXD0 | T10.5 65.3,51.1 65.6,51.4 65.9,51.4 v66,51.5
  Bottom 0.152: v46.6,52 47.55,52.95 47.6,52.9 51.7,52.9 52.9,51.7 54,51.7 55,51.7 | PROGCONN.2 65.87,62.67 65.8,62.6 65.8,60.4 64.9,59.5 64.9,54.1 64.1,53.3 58.7,53.3 58.3,53.7 57,53.7 55,51.7 | v66,51.5 60,51.5 59.8,51.7 55,51.7
VCC3  (via drill 0.35)
  Top 0.152: 54.6,53.03 R4.1 R13.1 R7.1 49.4,53 48.4,54 v46.1,54 46.1,53.9 41.6,49.4 39.5,49.4 39.1,49 39.1,47.2 39.2,47.1 | 54.6,53.03 54.95,53.05 55.55,52.45 R3.1 | 60.64,33.63 IC10.VCC | 33.8,52.2 33.4,52.6 33.2,52.8 33.2,54.1 C23.1 | R45.1 33.65,45.99 T45.2 36.46,47.96 36.6,48.1 | R6.1 39.4,30.7 38.8,31.3 R5.1 37,32.1 37.8,32.9 37.8,39.9 39.8,41.9 39.8,47.1 | 46.73,60.93 v46.8,61 48,61 48.33,60.67 IC20.3 | v32.1,68.4 32.1,65.95 32.4,65.95 | 54.6,53.03 57.37,53.03 v57.5,52.9
  Top 0.4: 36.6,47.2 36.6,48.1 36.6,51.7 | 41.9,47.1 v46.9,42.1 55,34 60,34 60.64,33.36 IC10.VCC 60.64,28.36 v61,28
  Top 0.406: 33.86,65.95 C22.+ | 33.86,65.95 32.4,65.95 31.8,65.95 31.8,54.6 32.2,54.2 C23.1 33.1,52.9 33.4,52.6 34.3,51.7 36.6,51.7 | 41.9,47.1 39.8,47.1 39.2,47.1 36.7,47.1 36.6,47.2 | 33.86,65.95 41.1,65.95 L20.2
  Bottom 0.152: 60.8,28.3 v61,28 | v46.1,54 46.8,54.7 v46.8,61 | 47.02,69.2 52.33,69.2 52.33,68.4 LED11.A@1 | v32.1,68.4 32.1,69.3 47.02,69.3 47.02,69.2 | LED10.A@1 47,68.4 47,69.2 47.02,69.2 | v57.5,52.9 64.5,52.9 65.4,53.8 65.4,58 67.53,60.13 PROGCONN.1
  Bottom 0.254: JP1.6 65.95,39.8 57.5,39.8 55.25,42.05 46.95,42.05 v46.9,42.1
VCC3_TOUCH
  Top 0.406: T45.3 35.04,50.16 35.4,49.8 R40.2
VDDHI  (via drill 0.35)
  Top 0.152: v38.7,2.6 39.8,2.6 39.9,2.5 41.6,2.5 43.4,4.3 43.4,5.5 42.16,6.74 TP70.TP | v36.9,5.8 IC70.5 C70.1 36.1,9.4 v36.1,8.4 | v33.4,5.8 IC60.5 33.4,8.1 33,8.5 32,8.5 C60.1 31.2,9.4 v31.2,8.4 | TP60.TP 29.38,7.62 v30.7,6.3 | C50.1 14.3,20.1 14.3,22.7 IC50.5 11.9,22.7 11.8,22.8 11.8,27.04 TP50.TP | C40.1 11.9,45.3 12.7,46.1 12.7,47.1 12.3,47.5 11.75,47.5 IC40.5 10.6,47.6 9.2,49 TP40.TP | 12,44.8 11.9,44.8 11.3,44.8 v10.4,45.7
  Top 0.254: C50.1 13.7,19 13.8,18.9 17.1,18.9 17.6,19.3 17.6,20.5 19,20.5 v21.1,22.6 | C40.1 11.9,44.8
  Top 0.406: R40.1 35.4,45.7 v35.3,45.6
  Bottom 0.152: v38.7,2.6 36.9,4.4 v36.9,5.8 | v30.7,6.3 31.2,5.8 v33.4,5.8 | v10.4,45.7 10.4,46.6 15.5,46.6 16.5,47.6 17.7,47.6 v18.6,48.5
  Bottom 0.254: v36.1,8.4 36.1,13.2 35.5,13.8 33.5,13.8 32.1,12.4 | 32.1,12.4 31.2,11.5 v31.2,8.4 | 32.1,12.4 32.1,21.3 31.7,21.7 30.8,22.6 v21.1,22.6
  Bottom 0.406: v35.3,45.6 31.8,45.6 31.3,46.1 | 31.3,46.1 28.9,48.5 v18.6,48.5 | 31.7,21.7 33.5,23.5 33.5,39.6 30.9,42.2 30.9,45.7 31.3,46.1
VIN
  Top 0.152: R20.1 42.2,68.5 42.8,69.1 50.8,69.1 50.87,69.03 IC20.10
  Top 0.406: D1.3 57.21,65 59,65 59.2,64.8 60.6,64.8 60.62,64.78 C20.+ 60.4,63.8 58.6,63.8 58.24,63.44 C21.1 52.46,63.44 50.87,65.03 IC20.10
VREG1
  Top 0.152: IC60.4 34.2,7.1 C61.1
VREG2
  Top 0.152: C41.1 11.9,48.8 IC40.4
VREG3
  Top 0.152: IC70.4 37.85,7.85 38.2,8.2 38.7,8.2 39,8.5 C71.1
VREG4
  Top 0.152: IC50.4 13.45,25.3 C51.1

### Text on the board
tPlace: 5..15V | GND | Reset
bPlace: Von Papa für Helena / zu Weihnachten 2017
tNames: RX | TX | VCC3 | VCC3 | GND | MISO | MOSI | SCK | !CS